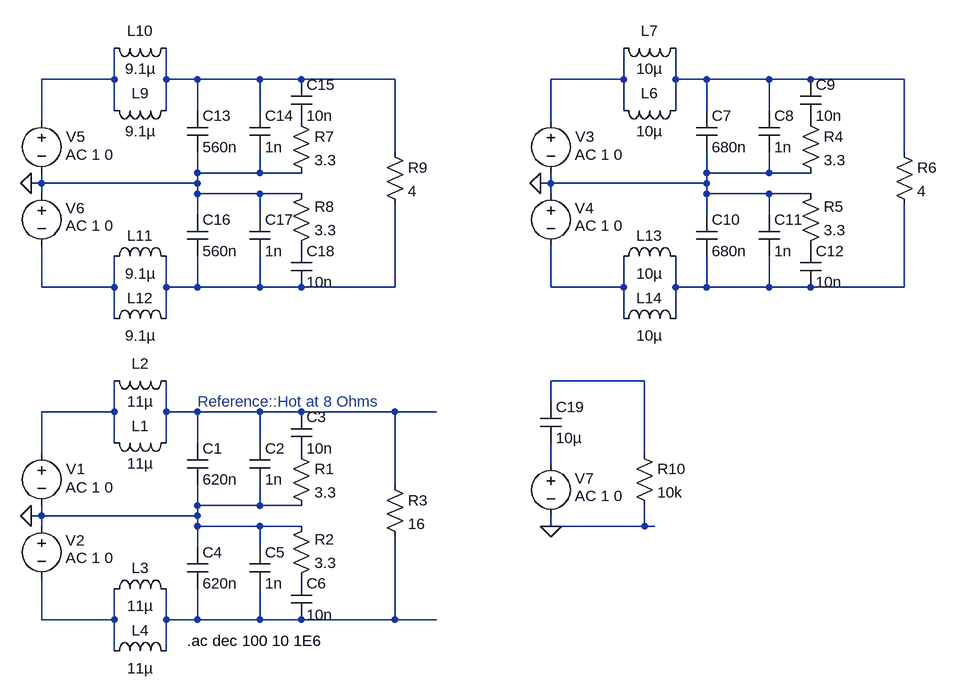
[diagram p0: schematic Amp_Output_Filter.asc]
Amp_Output_Filter.asc, the LTspice schematic file:
Version 4
SHEET 1 3208 892
WIRE 928 -32 928 -80
WIRE 928 -32 816 -32
WIRE 1008 -32 1008 -80
WIRE 1056 -32 1008 -32
WIRE 1152 -32 1056 -32
WIRE 1216 -32 1152 -32
WIRE 1360 -32 1216 -32
WIRE 1712 -32 1712 -80
WIRE 1712 -32 1600 -32
WIRE 1792 -32 1792 -80
WIRE 1840 -32 1792 -32
WIRE 1936 -32 1840 -32
WIRE 2000 -32 1936 -32
WIRE 2144 -32 2000 -32
WIRE 928 16 928 -32
WIRE 1008 16 1008 -32
WIRE 1056 16 1056 -32
WIRE 1152 16 1152 -32
WIRE 1712 16 1712 -32
WIRE 1792 16 1792 -32
WIRE 1840 16 1840 -32
WIRE 1936 16 1936 -32
WIRE 816 32 816 -32
WIRE 1600 32 1600 -32
WIRE 1360 80 1360 -32
WIRE 2144 80 2144 -32
WIRE 1056 112 1056 80
WIRE 1152 112 1152 80
WIRE 1152 112 1056 112
WIRE 1216 112 1152 112
WIRE 1840 112 1840 80
WIRE 1936 112 1936 80
WIRE 1936 112 1840 112
WIRE 2000 112 1936 112
WIRE 816 128 816 112
WIRE 816 128 800 128
WIRE 1056 128 1056 112
WIRE 1056 128 816 128
WIRE 1600 128 1600 112
WIRE 1600 128 1584 128
WIRE 1840 128 1840 112
WIRE 1840 128 1600 128
WIRE 816 144 816 128
WIRE 1056 144 1056 128
WIRE 1152 144 1056 144
WIRE 1216 144 1152 144
WIRE 1600 144 1600 128
WIRE 1840 144 1840 128
WIRE 1936 144 1840 144
WIRE 2000 144 1936 144
WIRE 1056 176 1056 144
WIRE 1152 176 1152 144
WIRE 1840 176 1840 144
WIRE 1936 176 1936 144
WIRE 816 288 816 224
WIRE 928 288 928 240
WIRE 928 288 816 288
WIRE 1008 288 1008 240
WIRE 1056 288 1056 240
WIRE 1056 288 1008 288
WIRE 1152 288 1152 240
WIRE 1152 288 1056 288
WIRE 1216 288 1152 288
WIRE 1360 288 1360 160
WIRE 1360 288 1216 288
WIRE 1600 288 1600 224
WIRE 1712 288 1712 240
WIRE 1712 288 1600 288
WIRE 1792 288 1792 240
WIRE 1840 288 1840 240
WIRE 1840 288 1792 288
WIRE 1936 288 1936 240
WIRE 1936 288 1840 288
WIRE 2000 288 1936 288
WIRE 2144 288 2144 160
WIRE 2144 288 2000 288
WIRE 928 336 928 288
WIRE 1008 336 1008 288
WIRE 1712 336 1712 288
WIRE 1792 336 1792 288
WIRE 1744 432 1600 432
WIRE 1600 464 1600 432
WIRE 928 480 928 432
WIRE 928 480 816 480
WIRE 1008 480 1008 432
WIRE 1056 480 1008 480
WIRE 1152 480 1056 480
WIRE 1216 480 1152 480
WIRE 1360 480 1216 480
WIRE 1424 480 1360 480
WIRE 928 528 928 480
WIRE 1008 528 1008 480
WIRE 1056 528 1056 480
WIRE 1152 528 1152 480
WIRE 816 544 816 480
WIRE 1744 544 1744 432
WIRE 1600 560 1600 528
WIRE 1360 592 1360 480
WIRE 1056 624 1056 592
WIRE 1152 624 1152 592
WIRE 1152 624 1056 624
WIRE 1216 624 1152 624
WIRE 816 640 816 624
WIRE 816 640 800 640
WIRE 1056 640 1056 624
WIRE 1056 640 816 640
WIRE 816 656 816 640
WIRE 1056 656 1056 640
WIRE 1152 656 1056 656
WIRE 1216 656 1152 656
WIRE 1600 656 1600 640
WIRE 1744 656 1744 624
WIRE 1744 656 1600 656
WIRE 1760 656 1744 656
WIRE 1056 688 1056 656
WIRE 1152 688 1152 656
WIRE 816 800 816 736
WIRE 928 800 928 752
WIRE 928 800 816 800
WIRE 1008 800 1008 752
WIRE 1056 800 1056 752
WIRE 1056 800 1008 800
WIRE 1152 800 1152 752
WIRE 1152 800 1056 800
WIRE 1216 800 1152 800
WIRE 1360 800 1360 672
WIRE 1360 800 1216 800
WIRE 1424 800 1360 800
WIRE 928 848 928 800
WIRE 1008 848 1008 800
FLAG 800 640 0
FLAG 800 128 0
FLAG 1584 128 0
FLAG 1600 656 0
SYMBOL voltage 816 528 R0
WINDOW 0 38 40 Left 2
WINDOW 3 38 65 Left 2
WINDOW 123 37 68 Left 2
WINDOW 39 0 0 Left 0
SYMATTR InstName V1
SYMATTR Value ""
SYMATTR Value2 AC 1 0
SYMBOL voltage 816 640 R0
WINDOW 0 37 38 Left 2
WINDOW 123 37 65 Left 2
WINDOW 39 0 0 Left 0
SYMATTR InstName V2
SYMATTR Value2 AC 1 0
SYMATTR Value ""
SYMBOL ind 1024 512 R90
WINDOW 0 5 56 VBottom 2
WINDOW 3 32 56 VTop 2
SYMATTR InstName L1
SYMATTR Value 11µ
SYMBOL ind 1024 416 R90
WINDOW 0 5 56 VBottom 2
WINDOW 3 32 56 VTop 2
SYMATTR InstName L2
SYMATTR Value 11µ
SYMBOL cap 1040 528 R0
SYMATTR InstName C1
SYMATTR Value 620n
SYMBOL cap 1136 528 R0
SYMATTR InstName C2
SYMATTR Value 1n
SYMBOL cap 1200 480 R0
SYMATTR InstName C3
SYMATTR Value 10n
SYMBOL res 1200 528 R0
SYMATTR InstName R1
SYMATTR Value 3.3
SYMBOL ind 1024 768 M270
WINDOW 0 32 56 VTop 2
WINDOW 3 5 56 VBottom 2
SYMATTR InstName L3
SYMATTR Value 11µ
SYMBOL ind 1024 864 M270
WINDOW 0 32 56 VTop 2
WINDOW 3 5 56 VBottom 2
SYMATTR InstName L4
SYMATTR Value 11µ
SYMBOL cap 1040 752 M180
WINDOW 0 24 56 Left 2
WINDOW 3 24 8 Left 2
SYMATTR InstName C4
SYMATTR Value 620n
SYMBOL cap 1136 752 M180
WINDOW 0 24 56 Left 2
WINDOW 3 24 8 Left 2
SYMATTR InstName C5
SYMATTR Value 1n
SYMBOL cap 1200 800 M180
WINDOW 0 24 56 Left 2
WINDOW 3 24 8 Left 2
SYMATTR InstName C6
SYMATTR Value 10n
SYMBOL res 1200 752 M180
WINDOW 0 36 76 Left 2
WINDOW 3 36 40 Left 2
SYMATTR InstName R2
SYMATTR Value 3.3
SYMBOL res 1344 576 R0
SYMATTR InstName R3
SYMATTR Value 16
SYMBOL voltage 816 16 R0
WINDOW 0 38 40 Left 2
WINDOW 3 38 65 Left 2
WINDOW 123 37 68 Left 2
WINDOW 39 0 0 Left 0
SYMATTR InstName V5
SYMATTR Value ""
SYMATTR Value2 AC 1 0
SYMBOL voltage 816 128 R0
WINDOW 0 37 38 Left 2
WINDOW 123 37 65 Left 2
WINDOW 39 0 0 Left 0
SYMATTR InstName V6
SYMATTR Value2 AC 1 0
SYMATTR Value ""
SYMBOL ind 1024 0 R90
WINDOW 0 5 56 VBottom 2
WINDOW 3 32 56 VTop 2
SYMATTR InstName L9
SYMATTR Value 9.1µ
SYMBOL ind 1024 -96 R90
WINDOW 0 5 56 VBottom 2
WINDOW 3 32 56 VTop 2
SYMATTR InstName L10
SYMATTR Value 9.1µ
SYMBOL cap 1040 16 R0
SYMATTR InstName C13
SYMATTR Value 560n
SYMBOL cap 1136 16 R0
SYMATTR InstName C14
SYMATTR Value 1n
SYMBOL cap 1200 -32 R0
SYMATTR InstName C15
SYMATTR Value 10n
SYMBOL res 1200 16 R0
SYMATTR InstName R7
SYMATTR Value 3.3
SYMBOL ind 1024 256 M270
WINDOW 0 32 56 VTop 2
WINDOW 3 5 56 VBottom 2
SYMATTR InstName L11
SYMATTR Value 9.1µ
SYMBOL ind 1024 352 M270
WINDOW 0 32 56 VTop 2
WINDOW 3 5 56 VBottom 2
SYMATTR InstName L12
SYMATTR Value 9.1µ
SYMBOL cap 1040 240 M180
WINDOW 0 24 56 Left 2
WINDOW 3 24 8 Left 2
SYMATTR InstName C16
SYMATTR Value 560n
SYMBOL cap 1136 240 M180
WINDOW 0 24 56 Left 2
WINDOW 3 24 8 Left 2
SYMATTR InstName C17
SYMATTR Value 1n
SYMBOL cap 1200 288 M180
WINDOW 0 24 56 Left 2
WINDOW 3 24 8 Left 2
SYMATTR InstName C18
SYMATTR Value 10n
SYMBOL res 1200 240 M180
WINDOW 0 36 76 Left 2
WINDOW 3 36 40 Left 2
SYMATTR InstName R8
SYMATTR Value 3.3
SYMBOL res 1344 64 R0
SYMATTR InstName R9
SYMATTR Value 4
SYMBOL voltage 1600 16 R0
WINDOW 0 38 40 Left 2
WINDOW 3 38 65 Left 2
WINDOW 123 37 68 Left 2
WINDOW 39 0 0 Left 0
SYMATTR InstName V3
SYMATTR Value ""
SYMATTR Value2 AC 1 0
SYMBOL voltage 1600 128 R0
WINDOW 0 37 38 Left 2
WINDOW 123 37 65 Left 2
WINDOW 39 0 0 Left 0
SYMATTR InstName V4
SYMATTR Value2 AC 1 0
SYMATTR Value ""
SYMBOL ind 1808 -96 R90
WINDOW 0 5 56 VBottom 2
WINDOW 3 32 56 VTop 2
SYMATTR InstName L7
SYMATTR Value 10µ
SYMBOL cap 1824 16 R0
SYMATTR InstName C7
SYMATTR Value 680n
SYMBOL cap 1920 16 R0
SYMATTR InstName C8
SYMATTR Value 1n
SYMBOL cap 1984 -32 R0
SYMATTR InstName C9
SYMATTR Value 10n
SYMBOL res 1984 16 R0
SYMATTR InstName R4
SYMATTR Value 3.3
SYMBOL ind 1808 256 M270
WINDOW 0 32 56 VTop 2
WINDOW 3 5 56 VBottom 2
SYMATTR InstName L13
SYMATTR Value 10µ
SYMBOL cap 1824 240 M180
WINDOW 0 24 56 Left 2
WINDOW 3 24 8 Left 2
SYMATTR InstName C10
SYMATTR Value 680n
SYMBOL cap 1920 240 M180
WINDOW 0 24 56 Left 2
WINDOW 3 24 8 Left 2
SYMATTR InstName C11
SYMATTR Value 1n
SYMBOL cap 1984 288 M180
WINDOW 0 24 56 Left 2
WINDOW 3 24 8 Left 2
SYMATTR InstName C12
SYMATTR Value 10n
SYMBOL res 1984 240 M180
WINDOW 0 36 76 Left 2
WINDOW 3 36 40 Left 2
SYMATTR InstName R5
SYMATTR Value 3.3
SYMBOL res 2128 64 R0
SYMATTR InstName R6
SYMATTR Value 4
SYMBOL ind 1808 0 R90
WINDOW 0 5 56 VBottom 2
WINDOW 3 32 56 VTop 2
SYMATTR InstName L6
SYMATTR Value 10µ
SYMBOL ind 1808 352 M270
WINDOW 0 32 56 VTop 2
WINDOW 3 5 56 VBottom 2
SYMATTR InstName L14
SYMATTR Value 10µ
SYMBOL voltage 1600 544 R0
WINDOW 0 37 38 Left 2
WINDOW 123 37 65 Left 2
WINDOW 39 0 0 Left 0
SYMATTR InstName V7
SYMATTR Value2 AC 1 0
SYMATTR Value ""
SYMBOL cap 1584 464 R0
SYMATTR InstName C19
SYMATTR Value 10µ
SYMBOL res 1728 528 R0
SYMATTR InstName R10
SYMATTR Value 10k
TEXT 1040 832 Left 2 !.ac dec 100 10 1E6
TEXT 1056 464 Left 2 ;Reference::Hot at 8 Ohms

The netlist it stands for:
* Amp_Output_Filter.asc
V1 N010 0 AC 1 0
V2 0 N013 AC 1 0
L1 N011 N010 11µ
L2 N011 N010 11µ
C1 N011 0 620n
C2 N011 0 1n
C3 N011 P001 10n
R1 P001 0 3.3
L3 N014 N013 11µ
L4 N014 N013 11µ
C4 N014 0 620n
C5 N014 0 1n
C6 N014 P002 10n
R2 P002 0 3.3
R3 N011 N014 16
V5 N001 0 AC 1 0
V6 0 N005 AC 1 0
L9 N002 N001 9.1µ
L10 N002 N001 9.1µ
C13 N002 0 560n
C14 N002 0 1n
C15 N002 P003 10n
R7 P003 0 3.3
L11 N006 N005 9.1µ
L12 N006 N005 9.1µ
C16 N006 0 560n
C17 N006 0 1n
C18 N006 P004 10n
R8 P004 0 3.3
R9 N002 N006 4
V3 N003 0 AC 1 0
V4 0 N007 AC 1 0
L7 N004 N003 10µ
C7 N004 0 680n
C8 N004 0 1n
C9 N004 P005 10n
R4 P005 0 3.3
L13 N008 N007 10µ
C10 N008 0 680n
C11 N008 0 1n
C12 N008 P006 10n
R5 P006 0 3.3
R6 N004 N008 4
L6 N004 N003 10µ
L14 N008 N007 10µ
V7 N012 0 AC 1 0
C19 N009 N012 10µ
R10 N009 0 10k
.ac dec 100 10 1E6
* Reference::Hot at 8 Ohms
.backanno
.end